# EAGLE design m6502-prototyping-board (EAGLE 9.4.2)
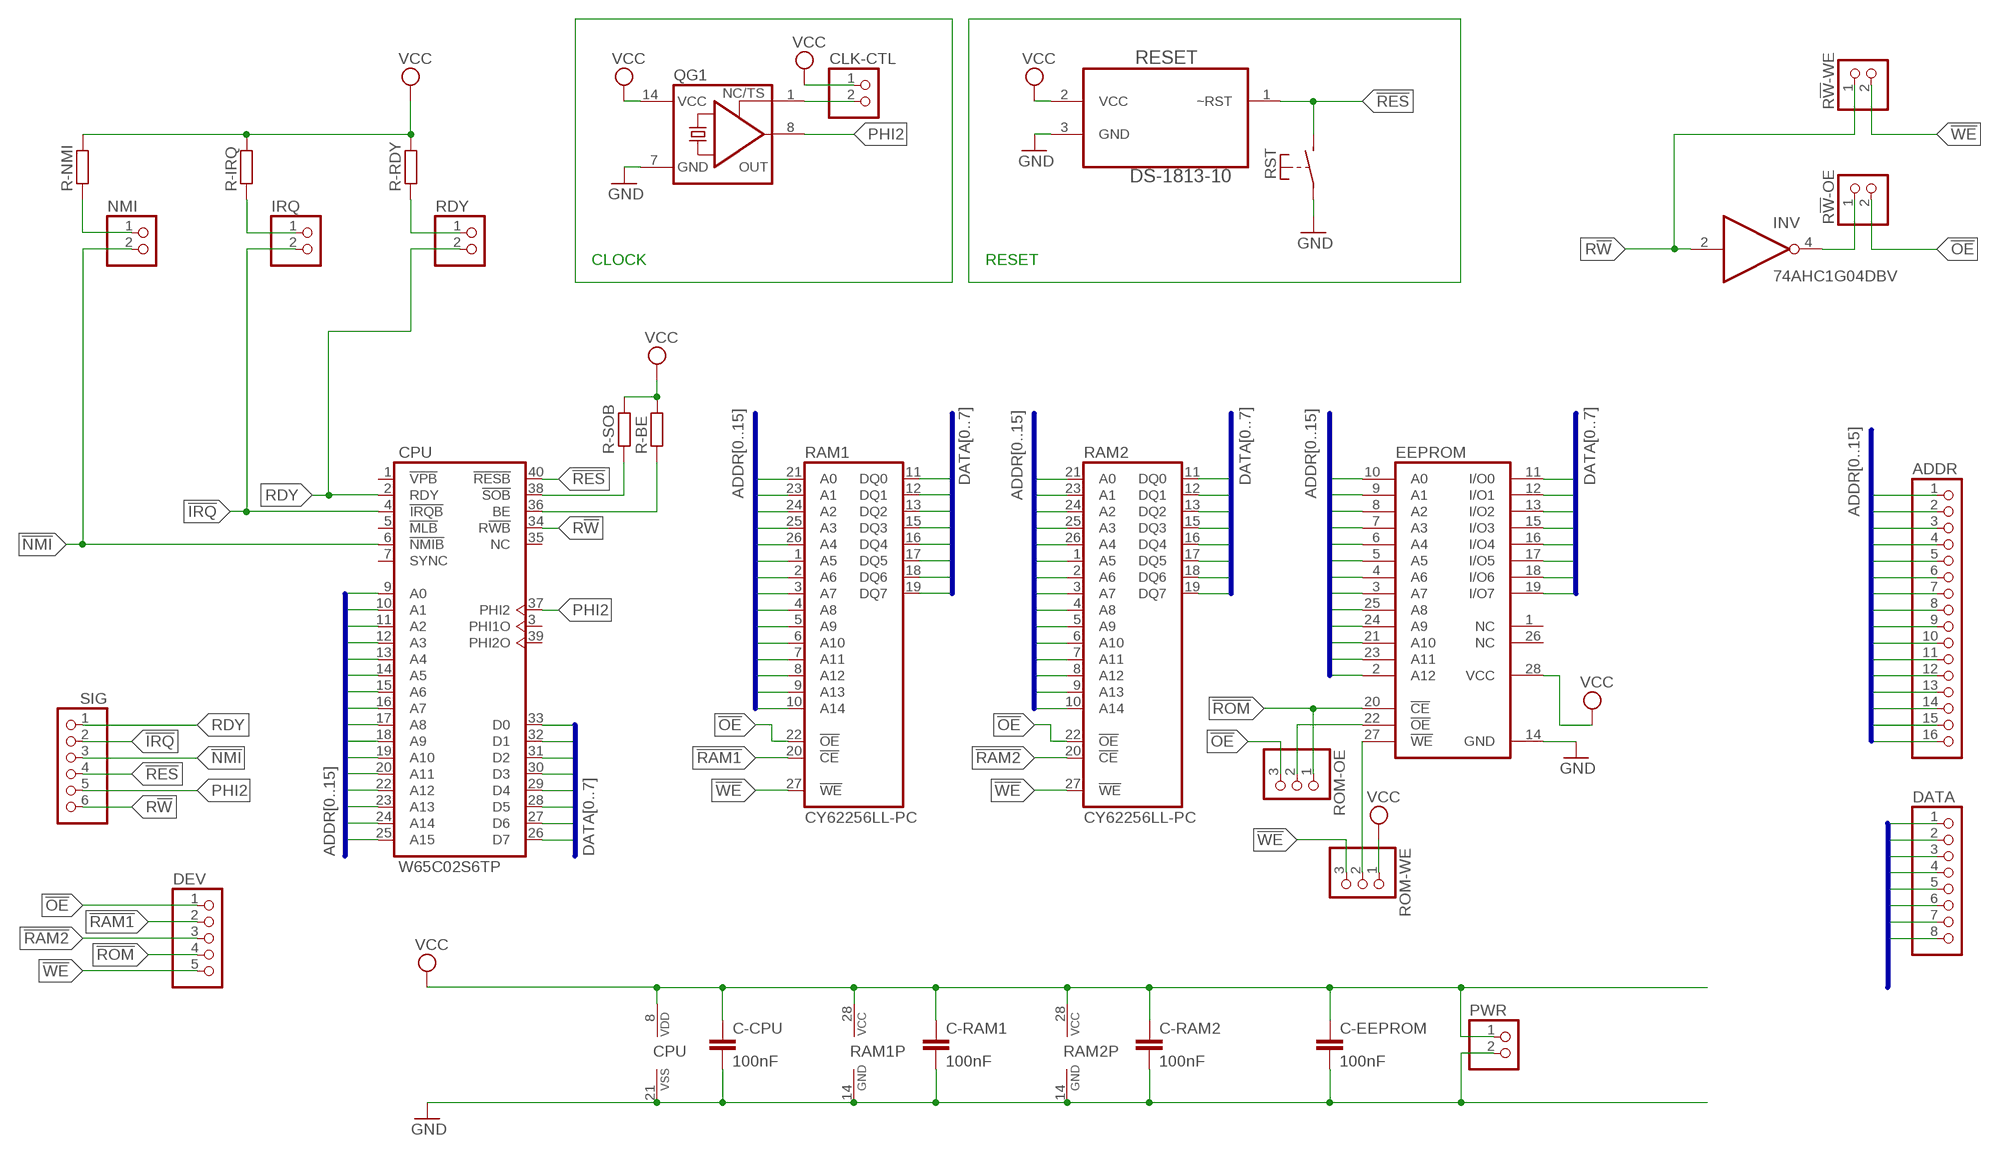
[diagram p0: schematic, sheet 1]

## Parts
ADDR  PINHD-1X16  [1X16]
C-CPU  100nF  C-EUC0805  [C0805]
C-EEPROM  100nF  C-EUC0805  [C0805]
C-RAM1  100nF  C-EUC0805  [C0805]
C-RAM2  100nF  C-EUC0805  [C0805]
CLK-CTL  PINHD-1X2  [1X02]
CPU  W65C02S6TP  [DIL40]
DATA  PINHD-1X8  [1X08]
DEV  PINHD-1X5  [1X05]
EEPROM  28C64C  [DIL28-6]
INV  74AHC1G04DBV  [SOT23-5]
IRQ  PINHD-1X2  [1X02]
NMI  PINHD-1X2  [1X02]
PWR  PINHD-1X2  [1X02]
QG1  XO-14  [DIL14S]
R!W!-OE  PINHD-1X2  [1X02]
R!W!-WE  PINHD-1X2  [1X02]
R-BE  R-EU_M1206  [M1206]
R-IRQ  R-EU_M1206  [M1206]
R-NMI  R-EU_M1206  [M1206]
R-RDY  R-EU_M1206  [M1206]
R-SOB  R-EU_M1206  [M1206]
RAM1  CY62256LL-PC  [DIL28-6]
RAM2  CY62256LL-PC  [DIL28-6]
RDY  PINHD-1X2  [1X02]
RESET  DS-1813-10  [TO-92]
ROM-OE  PINHD-1X3  [1X03]
ROM-WE  PINHD-1X3  [1X03]
RST  FSM  [FSM]
SIG  PINHD-1X6  [1X06]

## Nets
!IRQ: CPU.4(1:!IRQB) IRQ.2 SIG.2
!NMI: CPU.6(1:!NMIB) NMI.2 SIG.3
!OE: DEV.1 R!W!-OE.2 RAM1.22(!OE) RAM2.22(!OE) ROM-OE.3
!RAM1: DEV.2 RAM1.20(!CE)
!RAM2: DEV.3 RAM2.20(!CE)
!RES: CPU.40(1:!RESB) RESET.1(~RST) RST.P$2(S) SIG.4
!ROM: DEV.4 EEPROM.20(!CE) ROM-OE.1
!WE: DEV.5 R!W!-WE.2 RAM1.27(!WE) RAM2.27(!WE) ROM-WE.3
ADDR0: ADDR.1 CPU.9(1:A0) EEPROM.10(A0) RAM1.10(A14) RAM2.10(A14)
ADDR1: ADDR.2 CPU.10(1:A1) EEPROM.9(A1) RAM1.9(A13) RAM2.9(A13)
ADDR2: ADDR.3 CPU.11(1:A2) EEPROM.8(A2) RAM1.8(A12) RAM2.8(A12)
ADDR3: ADDR.4 CPU.12(1:A3) EEPROM.7(A3) RAM1.7(A11) RAM2.7(A11)
ADDR4: ADDR.5 CPU.13(1:A4) EEPROM.6(A4) RAM1.6(A10) RAM2.6(A10)
ADDR5: ADDR.6 CPU.14(1:A5) EEPROM.5(A5) RAM1.5(A9) RAM2.5(A9)
ADDR6: ADDR.7 CPU.15(1:A6) EEPROM.4(A6) RAM1.4(A8) RAM2.4(A8)
ADDR7: ADDR.8 CPU.16(1:A7) EEPROM.3(A7) RAM1.3(A7) RAM2.3(A7)
ADDR8: ADDR.9 CPU.17(1:A8) EEPROM.25(A8) RAM1.25(A3) RAM2.25(A3)
ADDR9: ADDR.10 CPU.18(1:A9) EEPROM.24(A9) RAM1.24(A2) RAM2.24(A2)
ADDR10: ADDR.11 CPU.19(1:A10) EEPROM.21(A10) RAM1.21(A0) RAM2.21(A0)
ADDR11: ADDR.12 CPU.20(1:A11) EEPROM.23(A11) RAM1.23(A1) RAM2.23(A1)
ADDR12: ADDR.13 CPU.22(1:A12) EEPROM.2(A12) RAM1.2(A6) RAM2.2(A6)
ADDR13: ADDR.14 CPU.23(1:A13) RAM1.26(A4) RAM2.26(A4)
ADDR14: ADDR.15 CPU.24(1:A14) RAM1.1(A5) RAM2.1(A5)
ADDR15: ADDR.16 CPU.25(1:A15)
DATA0: CPU.33(1:D0) DATA.1 EEPROM.11(I/O0) RAM1.11(DQ0) RAM2.11(DQ0)
DATA1: CPU.32(1:D1) DATA.2 EEPROM.12(I/O1) RAM1.12(DQ1) RAM2.12(DQ1)
DATA2: CPU.31(1:D2) DATA.3 EEPROM.13(I/O2) RAM1.13(DQ2) RAM2.13(DQ2)
DATA3: CPU.30(1:D3) DATA.4 EEPROM.15(I/O3) RAM1.15(DQ3) RAM2.15(DQ3)
DATA4: CPU.29(1:D4) DATA.5 EEPROM.16(I/O4) RAM1.16(DQ4) RAM2.16(DQ4)
DATA5: CPU.28(1:D5) DATA.6 EEPROM.17(I/O5) RAM1.17(DQ5) RAM2.17(DQ5)
DATA6: CPU.27(1:D6) DATA.7 EEPROM.18(I/O6) RAM1.18(DQ6) RAM2.18(DQ6)
DATA7: CPU.26(1:D7) DATA.8 EEPROM.19(I/O7) RAM1.19(DQ7) RAM2.19(DQ7)
GND: C-CPU.2 C-EEPROM.2 C-RAM1.2 C-RAM2.2 CPU.21(P:VSS) EEPROM.14(GND) PWR.2 QG1.7(GND) RAM1.14(GND) RAM2.14(GND) RESET.3(GND) RST.P$1(P)
N$1: NMI.1 R-NMI.1
N$2: IRQ.1 R-IRQ.1
N$3: EEPROM.27(!WE) ROM-WE.2
N$4: CPU.38(1:!SOB) R-SOB.1
N$5: EEPROM.22(!OE) ROM-OE.2
N$6: CPU.36(1:BE) R-BE.1
N$7: R-RDY.1 RDY.1
N$9: CLK-CTL.2 QG1.1(TS)
N$10: INV.4(O) R!W!-OE.1
PHI2: CPU.37(1:PHI2) QG1.8(OUT) SIG.5
R!W: CPU.34(1:R!WB) INV.2(I) R!W!-WE.1 SIG.6
RDY: CPU.2(1:RDY) RDY.2 SIG.1
VCC: C-CPU.1 C-EEPROM.1 C-RAM1.1 C-RAM2.1 CLK-CTL.1 CPU.8(P:VDD) EEPROM.28(VCC) PWR.1 QG1.14(VCC) R-BE.2 R-IRQ.2 R-NMI.2 R-RDY.2 R-SOB.2 RAM1.28(VCC) RAM2.28(VCC) RESET.2(VCC) ROM-WE.1
Unconnected: CPU.1(1:!VPB) CPU.3(1:PHI1O) CPU.5(1:!MLB) CPU.7(1:SYNC) CPU.35(1:NC) CPU.39(1:PHI2O) EEPROM.1(NC) EEPROM.26(NC)

## Buses
ADDR[0..15]
DATA[0..7]

## Notes on the sheet
- CLOCK | RESET

## Power pins joined to a net without a drawn wire
GND: INV.3(GND)
VCC: INV.5(VCC)

## Library data of the parts
ADDR = pinhead:PINHD-1X16: PIN HEADER
C-CPU C-EEPROM C-RAM1 C-RAM2 = rcl:C-EU: CAPACITOR, European symbol
CLK-CTL IRQ NMI PWR R!W!-OE R!W!-WE RDY = pinhead:PINHD-1X2: PIN HEADER
CPU = wdc:W65C02S: W65C02 by WDC
DATA = pinhead:PINHD-1X8: PIN HEADER
DEV = pinhead:PINHD-1X5: PIN HEADER
EEPROM = memory-nec:28C64C: MEMORY; MPN: AT28C64B-15PU; OC_FARNELL: 1095784; OC_NEWARK: 96K6557
INV = 74xx-little-us:74*1G04: INVERTER Gate
QG1 = crystal:XO-: CRYSTAL; OC_FARNELL: unknown; OC_NEWARK: unknown
R-BE R-IRQ R-NMI R-RDY R-SOB = rcl:R-EU_: RESISTOR, European symbol
RAM1 RAM2 = memory-sram:CY62256LL-?*: 256K (32K x 8) CMOS-Static RAM Source: http://download.cypress.com.edgesuite.net/design_resources/datasheets/contents/cy62256_8.pdf
RESET = ds1813:DS-1813-10
ROM-OE ROM-WE = pinhead:PINHD-1X3: PIN HEADER
RST = switch-misc:FSM: TYCO SWITCH
SIG = pinhead:PINHD-1X6: PIN HEADER

## Board
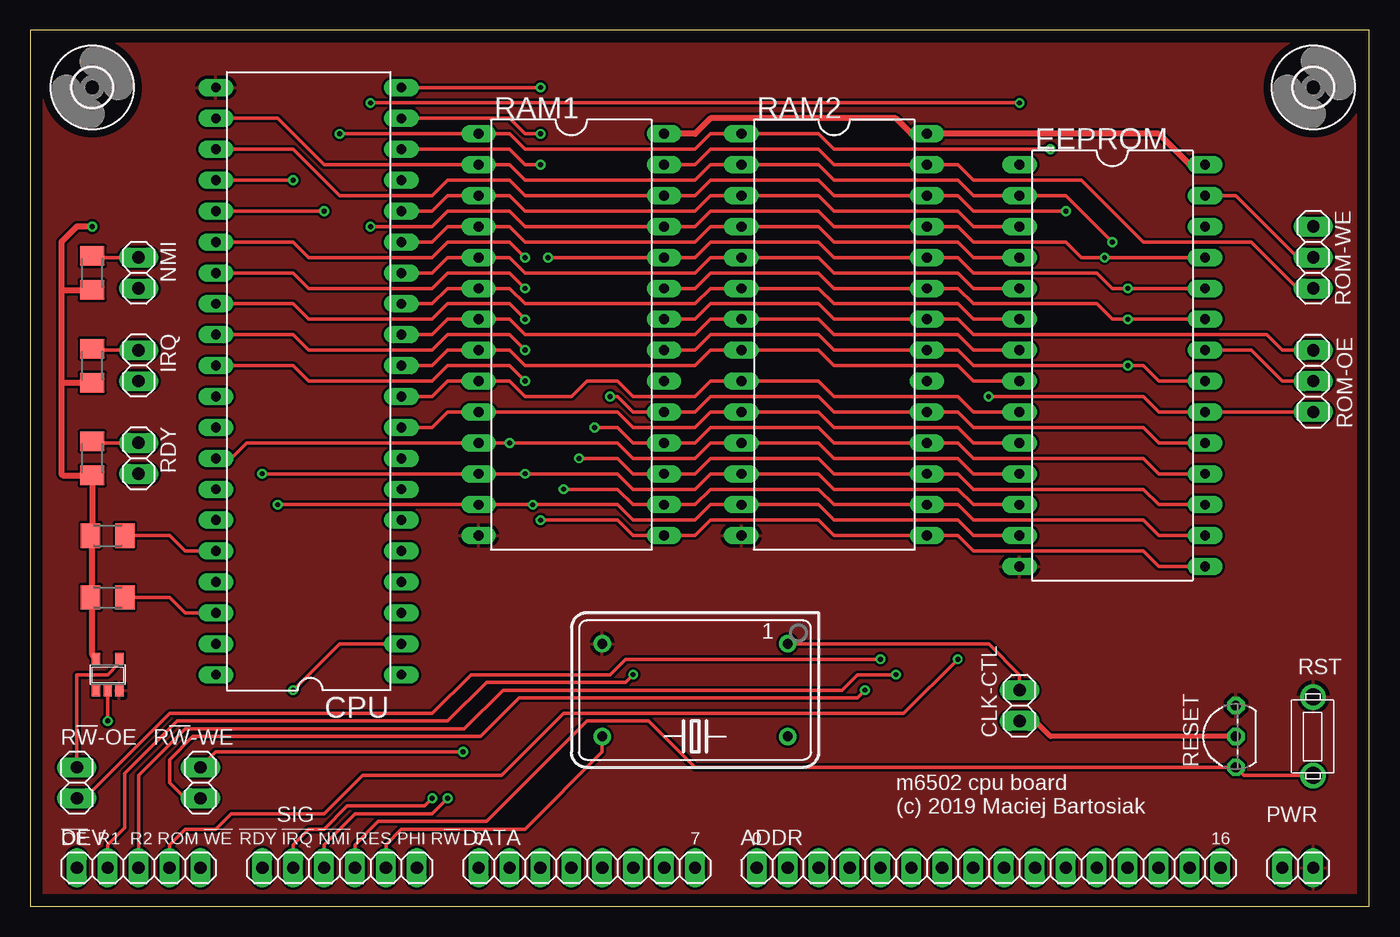
[diagram p1: board, top side]
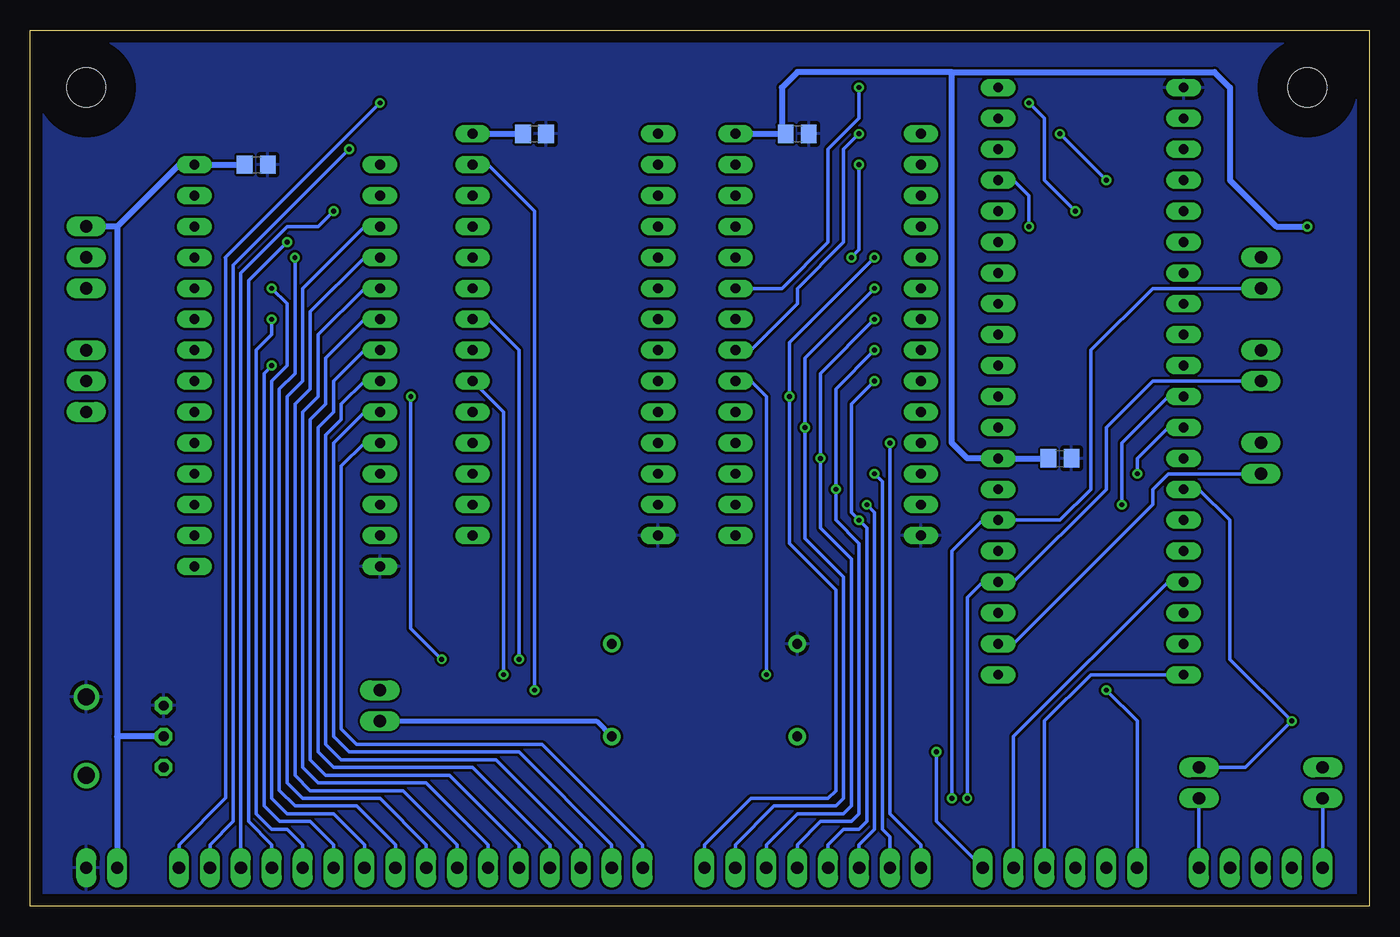
[diagram p2: board, bottom side, seen from below]

Size 110 x 72 mm. Coordinates in mm from the lower left corner, seen from the top.
Outline: 0,0 110,0 110,72 0,72 0,0
Copper layers (1*16): Top 0.035mm / dielectric 1.5mm / Bottom 0.035mm
Design rules "10mil *": minimum track width 12mil, minimum drill 0.4mm, track to track 8mil, track to pad 8mil, pad to pad 8mil, via to via 8mil, smd to smd 8mil, copper to edge 40mil, drill to drill 12mil, minimum pad ring 12mil, minimum via ring 8mil, stop-mask expansion 4mil, vias tented up to drill 0mil, thermal gap 12mil

### Footprints (pad centres in the part's own frame; a part is rotated, then mirrored left to right if it is on the bottom)
1X16 = drill 1.016 long: 1 -19.05,0; 2 -16.51,0; 3 -13.97,0; 4 -11.43,0; 5 -8.89,0; 6 -6.35,0; 7 -3.81,0; 8 -1.27,0; 9 1.27,0; 10 3.81,0; 11 6.35,0; 12 8.89,0; 13 11.43,0; 14 13.97,0; 15 16.51,0; 16 19.05,0
C0805 = smd 1.3 x 1.5: 1 -0.95,0; 2 0.95,0
1X02 = drill 1.016 long: 1 -1.27,0; 2 1.27,0
DIL40 = drill 0.813 long: 1 -24.13,-7.62; 2 -21.59,-7.62; 3 -19.05,-7.62; 4 -16.51,-7.62; 5 -13.97,-7.62; 6 -11.43,-7.62; 7 -8.89,-7.62; 8 -6.35,-7.62; 9 -3.81,-7.62; 10 -1.27,-7.62; 11 1.27,-7.62; 12 3.81,-7.62; 13 6.35,-7.62; 14 8.89,-7.62; 15 11.43,-7.62; 16 13.97,-7.62; 17 16.51,-7.62; 18 19.05,-7.62; 19 21.59,-7.62; 20 24.13,-7.62; 21 24.13,7.62; 22 21.59,7.62; 23 19.05,7.62; 24 16.51,7.62; 25 13.97,7.62; 26 11.43,7.62; 27 8.89,7.62; 28 6.35,7.62; 29 3.81,7.62; 30 1.27,7.62; 31 -1.27,7.62; 32 -3.81,7.62; 33 -6.35,7.62; 34 -8.89,7.62; 35 -11.43,7.62; 36 -13.97,7.62; 37 -16.51,7.62; 38 -19.05,7.62; 39 -21.59,7.62; 40 -24.13,7.62
1X08 = drill 1.016 long: 1 -8.89,0; 2 -6.35,0; 3 -3.81,0; 4 -1.27,0; 5 1.27,0; 6 3.81,0; 7 6.35,0; 8 8.89,0
1X05 = drill 1.016 long: 1 -5.08,0; 2 -2.54,0; 3 0,0; 4 2.54,0; 5 5.08,0
DIL28-6 = drill 0.813 long: 1 -16.51,-7.62; 2 -13.97,-7.62; 3 -11.43,-7.62; 4 -8.89,-7.62; 5 -6.35,-7.62; 6 -3.81,-7.62; 7 -1.27,-7.62; 8 1.27,-7.62; 9 3.81,-7.62; 10 6.35,-7.62; 11 8.89,-7.62; 12 11.43,-7.62; 13 13.97,-7.62; 14 16.51,-7.62; 15 16.51,7.62; 16 13.97,7.62; 17 11.43,7.62; 18 8.89,7.62; 19 6.35,7.62; 20 3.81,7.62; 21 1.27,7.62; 22 -1.27,7.62; 23 -3.81,7.62; 24 -6.35,7.62; 25 -8.89,7.62; 26 -11.43,7.62; 27 -13.97,7.62; 28 -16.51,7.62
SOT23-5 = smd 0.69 x 0.99: 1 -0.95,-1.29; 2 0,-1.29; 3 0.95,-1.29; 4 0.95,1.3; 5 -0.95,1.3
DIL14S = drill 0.813: 1 -7.62,-3.81; 7 7.62,-3.81; 8 7.62,3.81; 14 -7.62,3.81
M1206 = smd 1.6 x 2: 1 -1.4,0; 2 1.4,0
TO-92 = drill 0.813 octagon: 1 -2.54,0; 2 0,0; 3 2.54,0
1X03 = drill 1.016 long: 1 -2.54,0; 2 0,0; 3 2.54,0
FSM = drill 1.397: P$1 0,3.25; P$2 0,-3.2
1X06 = drill 1.016 long: 1 -6.35,0; 2 -3.81,0; 3 -1.27,0; 4 1.27,0; 5 3.81,0; 6 6.35,0
3,2 = hole 3.2: 0,0

### Placement (x,y rotation side)
ADDR  78.74,3.17 0 top
C-CPU  25.4,36.83 0 bottom
C-EEPROM  91.44,60.96 0 bottom
C-RAM1  46.99,63.5 0 bottom
C-RAM2  68.58,63.5 0 bottom
CLK-CTL  81.28,16.51 90 top
CPU  22.86,43.18 90 top
DATA  45.72,3.17 0 top
DEV  8.89,3.17 0 top
EEPROM  88.9,44.45 270 top
INV  6.35,19.05 0 top
IRQ  8.89,44.45 270 top
NMI  8.89,52.07 270 top
PWR  104.14,3.17 0 top
QG1  54.61,17.78 180 top
R!W!-OE  3.81,10.16 270 top
R!W!-WE  13.97,10.16 270 top
R-BE  6.35,30.48 180 top
R-IRQ  5.08,44.45 270 top
R-NMI  5.08,52.07 270 top
R-RDY  5.08,36.83 270 top
R-SOB  6.35,25.4 180 top
RAM1  44.45,46.99 270 top
RAM2  66.04,46.99 270 top
RDY  8.89,36.83 270 top
RESET  99.06,13.97 90 top
ROM-OE  105.41,43.18 90 top
ROM-WE  105.41,53.34 270 top
RST  105.41,13.97 0 top
SIG  25.4,3.17 0 top
U$1  [3,2]  5.08,67.31 0 top
U$2  [3,2]  105.41,67.31 0 top

### Tracks (layer width: path | path; a pad name or v marks a point on that pad's centre or on a via)
!IRQ  (via drill 0.4)
  Top 0.305: v33.02,8.89 32.38,8.26 26.04,8.26 24.13,6.35 22.86,6.35 21.59,5.08 SIG.2
  Bottom 0.305: IRQ.2 17.78,43.18 21.59,39.37 21.59,34.29 29.21,26.67 CPU.4 31.75,26.67 33.02,25.4 v33.02,8.89
!NMI  (via drill 0.4)
  Top 0.305: v34.29,8.89 33.02,7.62 26.67,7.62 24.13,5.08 SIG.3
  Bottom 0.305: NMI.2 17.78,50.8 22.86,45.72 22.86,34.29 25.4,31.75 CPU.6 31.75,31.75 34.29,29.21 v34.29,8.89
!OE  (via drill 0.4)
  Top 0.305: RAM1.22 54.61,48.26 55.88,49.53 64.77,49.53 66.04,48.26 RAM2.22 76.2,48.26 77.47,46.99 101.6,46.99 102.87,45.72 ROM-OE.3 | v69.85,20.32 48.9,20.32 47.62,19.05 36.2,19.05 33.02,15.88 11.43,15.88 4.45,8.89 R!W!-OE.2
  Bottom 0.305: RAM2.22 72.39,48.26 69.85,45.72 v69.85,20.32 | R!W!-OE.2 DEV.1
!RAM1  (via drill 0.4)
  Top 0.305: v49.53,19.05 48.9,18.41 37.47,18.41 34.29,15.24 12.06,15.24 7.75,10.92 7.75,6.48 6.35,5.08 DEV.2
  Bottom 0.305: RAM1.20 50.8,43.18 49.53,41.91 v49.53,19.05
!RAM2  (via drill 0.4)
  Top 0.305: v71.12,19.05 67.94,19.05 66.67,17.78 38.82,17.78 35.64,14.61 12.7,14.61 8.89,10.79 DEV.3
  Bottom 0.305: RAM2.20 71.12,40.64 v71.12,19.05
!RES
  Top 0.305: RST.P$2 99.72,10.77 RESET.1 54.61,11.43 50.8,15.24 45.72,15.24 37.47,6.99 28.57,6.99 26.67,5.08 SIG.4
  Bottom 0.305: CPU.40 22.86,19.05 26.67,15.24 SIG.4
!ROM  (via drill 0.4)
  Top 0.305: ROM-OE.1 EEPROM.20 92.71,40.64 91.44,41.91 v78.74,41.91 | v76.2,20.32 71.75,15.88 43.81,15.88 38.73,10.79 27.3,10.79 24.13,7.62 16.51,7.62 15.24,6.35 12.7,6.35 11.43,5.08 DEV.4
  Bottom 0.305: v76.2,20.32 78.74,22.86 v78.74,41.91
!WE  (via drill 0.4)
  Top 0.305: RAM1.27 54.61,60.96 55.88,62.23 64.77,62.23 66.04,60.96 RAM2.27 76.2,60.96 77.47,59.69 86.36,59.69 91.44,54.61 100.33,54.61 104.14,50.8 ROM-WE.3 | v68.58,17.78 67.94,17.14 40.17,17.14 37,13.97 13.34,13.97 11.43,12.06 11.43,10.16 12.7,8.89 R!W!-WE.2
  Bottom 0.305: RAM2.27 72.39,60.96 68.58,57.15 v68.58,17.78 | R!W!-WE.2 DEV.5
ADDR0
  Top 0.305: EEPROM.10 77.47,38.1 76.2,39.37 66.04,39.37 64.77,40.64 RAM2.10 55.88,40.64 54.61,39.37 49.53,39.37 48.26,40.64 RAM1.10 34.29,40.64 33.02,39.37 CPU.9
  Bottom 0.305: EEPROM.10 82.55,38.1 84.45,36.2 84.45,14.61 83.19,13.34 67.94,13.34 59.69,5.08 ADDR.1
ADDR1
  Top 0.305: EEPROM.9 77.47,40.64 76.2,41.91 66.04,41.91 64.77,43.18 RAM2.9 55.88,43.18 54.61,41.91 49.53,41.91 48.26,43.18 45.72,43.18 44.45,41.91 40.64,41.91 39.37,43.18 RAM1.9 34.29,43.18 33.02,41.91 CPU.10
  Bottom 0.305: EEPROM.9 82.55,40.64 85.09,38.1 85.09,13.97 83.82,12.7 69.85,12.7 62.23,5.08 ADDR.2
ADDR2
  Top 0.305: EEPROM.8 77.47,43.18 76.2,44.45 66.04,44.45 64.77,45.72 RAM2.8 55.88,45.72 54.61,44.45 40.64,44.45 39.37,45.72 RAM1.8 34.29,45.72 33.02,44.45 CPU.11
  Bottom 0.305: EEPROM.8 82.55,43.18 84.45,41.27 84.45,40.01 85.72,38.73 85.72,13.34 84.45,12.06 71.75,12.06 64.77,5.08 ADDR.3
ADDR3
  Top 0.305: EEPROM.7 77.47,45.72 76.2,46.99 66.04,46.99 64.77,48.26 RAM2.7 55.88,48.26 54.61,46.99 40.64,46.99 39.37,48.26 RAM1.7 34.29,48.26 33.02,46.99 CPU.12
  Bottom 0.305: EEPROM.7 82.55,45.72 85.09,43.18 85.09,40.64 86.36,39.37 86.36,12.7 85.09,11.43 73.66,11.43 67.31,5.08 ADDR.4
ADDR4
  Top 0.305: EEPROM.6 77.47,48.26 76.2,49.53 66.04,49.53 64.77,50.8 RAM2.6 55.88,50.8 54.61,49.53 40.64,49.53 39.37,50.8 RAM1.6 34.29,50.8 33.02,49.53 CPU.13
  Bottom 0.305: EEPROM.6 82.55,48.26 85.72,45.09 85.72,41.27 87,40.01 87,12.06 85.72,10.79 75.56,10.79 69.85,5.08 ADDR.5
ADDR5
  Top 0.305: EEPROM.5 77.47,50.8 76.2,52.07 66.04,52.07 64.77,53.34 RAM2.5 55.88,53.34 54.61,52.07 40.64,52.07 39.37,53.34 RAM1.5 34.29,53.34 33.02,52.07 CPU.14
  Bottom 0.305: EEPROM.5 82.55,50.8 86.36,46.99 86.36,41.91 87.63,40.64 87.63,11.43 86.36,10.16 77.47,10.16 72.39,5.08 ADDR.6
ADDR6
  Top 0.305: EEPROM.4 77.47,53.34 76.2,54.61 66.04,54.61 64.77,55.88 RAM2.4 55.88,55.88 54.61,54.61 40.64,54.61 39.37,55.88 RAM1.4 34.29,55.88 33.02,54.61 CPU.15
  Bottom 0.305: EEPROM.4 82.55,53.34 87,48.9 87,42.55 88.27,41.27 88.27,10.79 87,9.53 79.38,9.53 74.93,5.08 ADDR.7
ADDR7
  Top 0.305: EEPROM.3 77.47,55.88 76.2,57.15 66.04,57.15 64.77,58.42 RAM2.3 55.88,58.42 54.61,57.15 40.64,57.15 39.37,58.42 RAM1.3 34.29,58.42 33.02,57.15 CPU.16
  Bottom 0.305: EEPROM.3 82.55,55.88 87.63,50.8 87.63,43.18 88.9,41.91 88.9,10.16 87.63,8.89 81.28,8.89 77.47,5.08 ADDR.8
ADDR8  (via drill 0.4)
  Top 0.305: EEPROM.25 v88.27,53.34 86.36,53.34 85.09,54.61 77.47,54.61 76.2,55.88 RAM2.25 66.04,55.88 64.77,57.15 55.88,57.15 54.61,55.88 RAM1.25 40.64,55.88 39.37,57.15 34.29,57.15 33.02,55.88 v27.94,55.88
  Bottom 0.305: v27.94,55.88 27.94,58.42 29.21,59.69 CPU.17 | v88.27,53.34 88.27,43.81 89.56,42.52 89.56,9.55 88.27,8.26 83.19,8.26 80.01,5.08 ADDR.9
ADDR9  (via drill 0.4)
  Top 0.305: EEPROM.24 v90.17,50.8 88.9,50.8 87.63,52.07 77.47,52.07 76.2,53.34 RAM2.24 66.04,53.34 64.77,54.61 55.88,54.61 54.61,53.34 RAM1.24 v42.55,53.34 | CPU.18 39.37,62.23 40.64,60.96 v41.91,60.96
  Bottom 0.305: v41.91,60.96 41.91,53.98 v42.55,53.34 | v90.17,50.8 88.9,49.53 88.9,44.45 90.17,43.18 90.17,8.89 88.9,7.62 85.09,7.62 82.55,5.08 ADDR.10
ADDR10  (via drill 0.4)
  Top 0.305: EEPROM.21 92.71,43.18 91.44,44.45 v90.17,44.45 77.47,44.45 76.2,45.72 RAM2.21 66.04,45.72 64.77,46.99 55.88,46.99 54.61,45.72 RAM1.21 | CPU.19 39.37,64.77 40.64,63.5 v41.91,63.5
  Bottom 0.305: v90.17,44.45 90.81,43.81 90.81,8.26 89.53,6.99 87,6.99 85.09,5.08 ADDR.11 | v41.91,63.5 43.18,62.23 43.18,54.61 46.99,50.8 46.99,49.53 50.8,45.72 RAM1.21
ADDR11  (via drill 0.4)
  Top 0.305: EEPROM.23 v90.17,48.26 88.9,48.26 87.63,49.53 77.47,49.53 76.2,50.8 RAM2.23 66.04,50.8 64.77,52.07 55.88,52.07 54.61,50.8 RAM1.23 | CPU.20 v41.91,67.31
  Bottom 0.305: v90.17,48.26 90.17,46.99 91.44,45.72 91.44,7.62 90.17,6.35 88.9,6.35 87.63,5.08 ADDR.12 | v41.91,67.31 41.91,64.77 44.45,62.23 44.45,54.61 48.26,50.8 RAM1.23
ADDR12  (via drill 0.4)
  Top 0.305: CPU.22 20.32,64.77 24.13,60.96 RAM1.2 39.37,60.96 40.64,59.69 54.61,59.69 55.88,60.96 RAM2.2 64.77,60.96 66.04,59.69 76.2,59.69 77.47,58.42 EEPROM.2 85.09,58.42 v88.9,54.61
  Bottom 0.305: v88.9,54.61 92.08,51.44 92.08,6.99 90.17,5.08 ADDR.13
ADDR13  (via drill 0.4)
  Top 0.305: v85.09,57.15 77.47,57.15 76.2,58.42 RAM2.26 66.04,58.42 64.77,59.69 55.88,59.69 54.61,58.42 RAM1.26 40.64,58.42 39.37,59.69 34.29,59.69 33.02,58.42 25.4,58.42 21.59,62.23 CPU.23
  Bottom 0.305: v85.09,57.15 86.36,55.88 88.9,55.88 92.71,52.07 ADDR.14
ADDR14  (via drill 0.4)
  Top 0.305: v25.4,63.5 RAM1.1 39.37,63.5 40.64,62.23 54.61,62.23 55.88,63.5 RAM2.1 64.77,63.5 66.04,62.23 v83.82,62.23 | v21.59,59.69 CPU.24
  Bottom 0.305: v83.82,62.23 93.34,52.7 93.34,6.99 95.25,5.08 ADDR.15 | v25.4,63.5 v21.59,59.69
ADDR15  (via drill 0.4)
  Top 0.305: v81.28,66.04 v27.94,66.04 | v24.13,57.15 CPU.25
  Bottom 0.305: v81.28,66.04 93.98,53.34 93.95,53.31 93.95,8.91 97.79,5.08 ADDR.16 | v27.94,66.04 26.67,64.77 26.67,59.69 v24.13,57.15
DATA0  (via drill 0.4)
  Top 0.305: EEPROM.11 77.47,35.56 76.2,36.83 66.04,36.83 64.77,38.1 RAM2.11 55.88,38.1 54.61,36.83 49.53,36.83 48.26,38.1 v39.37,38.1 RAM1.11 17.78,38.1 16.51,36.83 CPU.33
  Bottom 0.305: v39.37,38.1 39.37,7.62 36.83,5.08 DATA.1
DATA1  (via drill 0.4)
  Top 0.305: EEPROM.12 77.47,33.02 76.2,34.29 66.04,34.29 64.77,35.56 RAM2.12 55.88,35.56 54.61,34.29 49.53,34.29 48.26,35.56 v40.64,35.56 RAM1.12 v19.05,35.56
  Bottom 0.305: CPU.32 16.51,39.37 19.05,36.83 v19.05,35.56 | v40.64,35.56 40.01,34.92 40.01,6.35 39.37,5.71 DATA.2
DATA2  (via drill 0.4)
  Top 0.305: EEPROM.13 77.47,30.48 76.2,31.75 66.04,31.75 64.77,33.02 RAM2.13 55.88,33.02 54.61,31.75 49.53,31.75 48.26,33.02 v41.27,33.02 RAM1.13 v20.32,33.02
  Bottom 0.305: CPU.31 16.51,41.91 20.32,38.1 v20.32,33.02 | v41.27,33.02 40.64,32.38 40.64,6.35 41.91,5.08 DATA.3
DATA3  (via drill 0.4)
  Top 0.305: EEPROM.15 92.71,27.94 91.44,29.21 77.47,29.21 76.2,30.48 RAM2.15 66.04,30.48 64.77,31.75 55.88,31.75 54.61,30.48 RAM1.15 49.53,30.48 48.26,31.75 v41.91,31.75 | CPU.30 21.59,44.45 22.86,43.18 33.02,43.18 34.29,44.45 39.37,44.45 v40.64,43.18
  Bottom 0.305: v40.64,43.18 42.55,41.27 42.55,32.38 v41.91,31.75 41.27,31.11 41.27,6.99 41.91,6.35 43.18,6.35 44.45,5.08 DATA.4
DATA4  (via drill 0.4)
  Top 0.305: EEPROM.16 92.71,30.48 91.44,31.75 77.47,31.75 76.2,33.02 RAM2.16 66.04,33.02 64.77,34.29 55.88,34.29 54.61,33.02 RAM1.16 49.53,33.02 48.26,34.29 v43.81,34.29 | v40.64,45.72 39.37,46.99 34.29,46.99 33.02,45.72 22.86,45.72 21.59,46.99 CPU.29
  Bottom 0.305: v40.64,45.72 43.81,42.55 v43.81,34.29 43.81,31.75 41.91,29.84 41.91,7.62 42.55,6.99 45.09,6.99 46.99,5.08 DATA.5
DATA5  (via drill 0.4)
  Top 0.305: EEPROM.17 92.71,33.02 91.44,34.29 77.47,34.29 76.2,35.56 RAM2.17 66.04,35.56 64.77,36.83 55.88,36.83 54.61,35.56 RAM1.17 49.53,35.56 48.26,36.83 v45.09,36.83 | CPU.28 21.59,49.53 22.86,48.26 33.02,48.26 34.29,49.53 39.37,49.53 v40.64,48.26
  Bottom 0.305: v40.64,48.26 45.09,43.81 v45.09,36.83 45.09,31.11 42.55,28.57 42.55,8.26 43.18,7.62 46.99,7.62 49.53,5.08 DATA.6
DATA6  (via drill 0.4)
  Top 0.305: EEPROM.18 92.71,35.56 91.44,36.83 77.47,36.83 76.2,38.1 RAM2.18 66.04,38.1 64.77,39.37 55.88,39.37 54.61,38.1 RAM1.18 49.53,38.1 48.26,39.37 v46.35,39.37 | v40.64,50.8 39.37,52.07 34.29,52.07 33.02,50.8 22.86,50.8 21.59,52.07 CPU.27
  Bottom 0.305: v40.64,50.8 46.35,45.09 v46.35,39.37 46.35,30.25 43.18,27.08 43.18,8.89 43.81,8.26 48.9,8.26 52.07,5.08 DATA.7
DATA7  (via drill 0.4)
  Top 0.305: v40.64,53.34 39.37,54.61 34.29,54.61 33.02,53.34 22.86,53.34 21.59,54.61 CPU.26 | EEPROM.19 92.71,38.1 91.44,39.37 77.47,39.37 76.2,40.64 RAM2.19 66.04,40.64 64.77,41.91 55.88,41.91 54.61,40.64 RAM1.19 49.53,40.64 48.26,41.91 v47.62,41.91
  Bottom 0.305: v40.64,53.34 47.62,46.35 v47.62,41.91 47.62,29.84 43.81,26.04 43.81,9.53 44.45,8.89 50.8,8.89 54.61,5.08 DATA.8
GND
  pour Top: -2.54,73.66 114.3,73.66 114.3,-1.27 -2.54,-1.27
  pour Bottom: -1.27,74.93 113.03,74.93 113.03,-2.54 -1.27,-2.54
N$1
  Top 0.305: NMI.1 5.21,53.34 R-NMI.1
N$2
  Top 0.305: IRQ.1 5.21,45.72 R-IRQ.1
N$3
  Top 0.305: EEPROM.27 99.06,58.42 104.14,53.34 ROM-WE.2
N$4
  Top 0.305: CPU.38 12.7,24.13 11.43,25.4 R-SOB.1
N$5
  Top 0.305: EEPROM.22 100.33,45.72 102.87,43.18 ROM-OE.2
N$6
  Top 0.305: CPU.36 12.7,29.21 11.43,30.48 R-BE.1
N$7
  Top 0.305: RDY.1 5.21,38.1 R-RDY.1
N$9
  Top 0.305: CLK-CTL.2 81.28,19.05 78.74,21.59 QG1.1
N$10
  Top 0.305: INV.4 7.3,20 6.35,19.05 3.81,19.05 R!W!-OE.1
PHI2
  Top 0.305: QG1.8 46.99,12.7 40.64,6.35 30.48,6.35 29.21,5.08 SIG.5
  Bottom 0.305: CPU.37 16.51,26.67 29.21,13.97 SIG.5
R!W  (via drill 0.4)
  Top 0.305: R!W!-WE.1 15.24,12.7 v35.56,12.7 | v6.35,15.24 INV.2
  Bottom 0.305: v35.56,12.7 35.56,6.99 SIG.6 | R!W!-WE.1 10.16,11.43 v6.35,15.24 11.43,20.32 11.43,31.75 13.97,34.29 CPU.34
RDY  (via drill 0.4)
  Top 0.305: CPU.2 25.4,21.59 v21.59,17.78
  Bottom 0.305: CPU.2 29.21,21.59 17.78,33.02 17.78,34.29 16.51,35.56 RDY.2 | v21.59,17.78 19.05,15.24 SIG.1
VCC  (via drill 0.4)
  Top 0.406: RESET.2 83.82,13.97 82.55,15.24 CLK-CTL.1
  Top 0.508: EEPROM.28 95.25,60.96 92.71,63.5 RAM2.28 72.39,63.5 71.12,64.77 55.88,64.77 54.61,63.5 RAM1.28 | v5.08,55.88 3.81,55.88 2.54,54.61 2.54,50.8 | 2.54,50.8 2.67,50.67 R-NMI.2 | 2.54,50.8 2.54,43.18 | 2.54,43.18 2.67,43.05 R-IRQ.2 | 2.54,43.18 2.54,35.56 2.67,35.43 R-RDY.2 5.08,30.61 R-BE.2 5.08,30.35 5.08,25.53 R-SOB.2 5.08,25.27 5.08,20.67 INV.5
  Bottom 0.406: CLK-CTL.1 63.5,15.24 QG1.14
  Bottom 0.508: 102.87,55.88 97.79,60.96 EEPROM.28 C-EEPROM.1 | 102.87,55.88 102.87,13.97 | RESET.2 102.87,13.97 | RAM2.28 C-RAM2.1 | RAM1.28 48.26,63.5 | 48.26,63.5 C-RAM1.1 | C-CPU.1 CPU.8 33.02,36.83 34.29,38.1 34.29,68.58 | 34.29,68.58 46.99,68.58 48.26,67.31 48.26,63.5 | v5.08,55.88 7.62,55.88 11.43,59.69 11.43,67.31 12.7,68.58 34.29,68.58 | 102.87,55.88 ROM-WE.1 | 102.87,13.97 PWR.1

### Text on the board
tNames: m6502 cpu board / (c) 2019 Maciej Bartosiak | !OE! R1 R2 ROM !WE! | !RDY! !IRQ! !NMI! RES PHI R!W! | 0 | 7 | 0 | 16
tValues: + | -